# EAGLE design ScanGen10 (EAGLE 7.2.0)
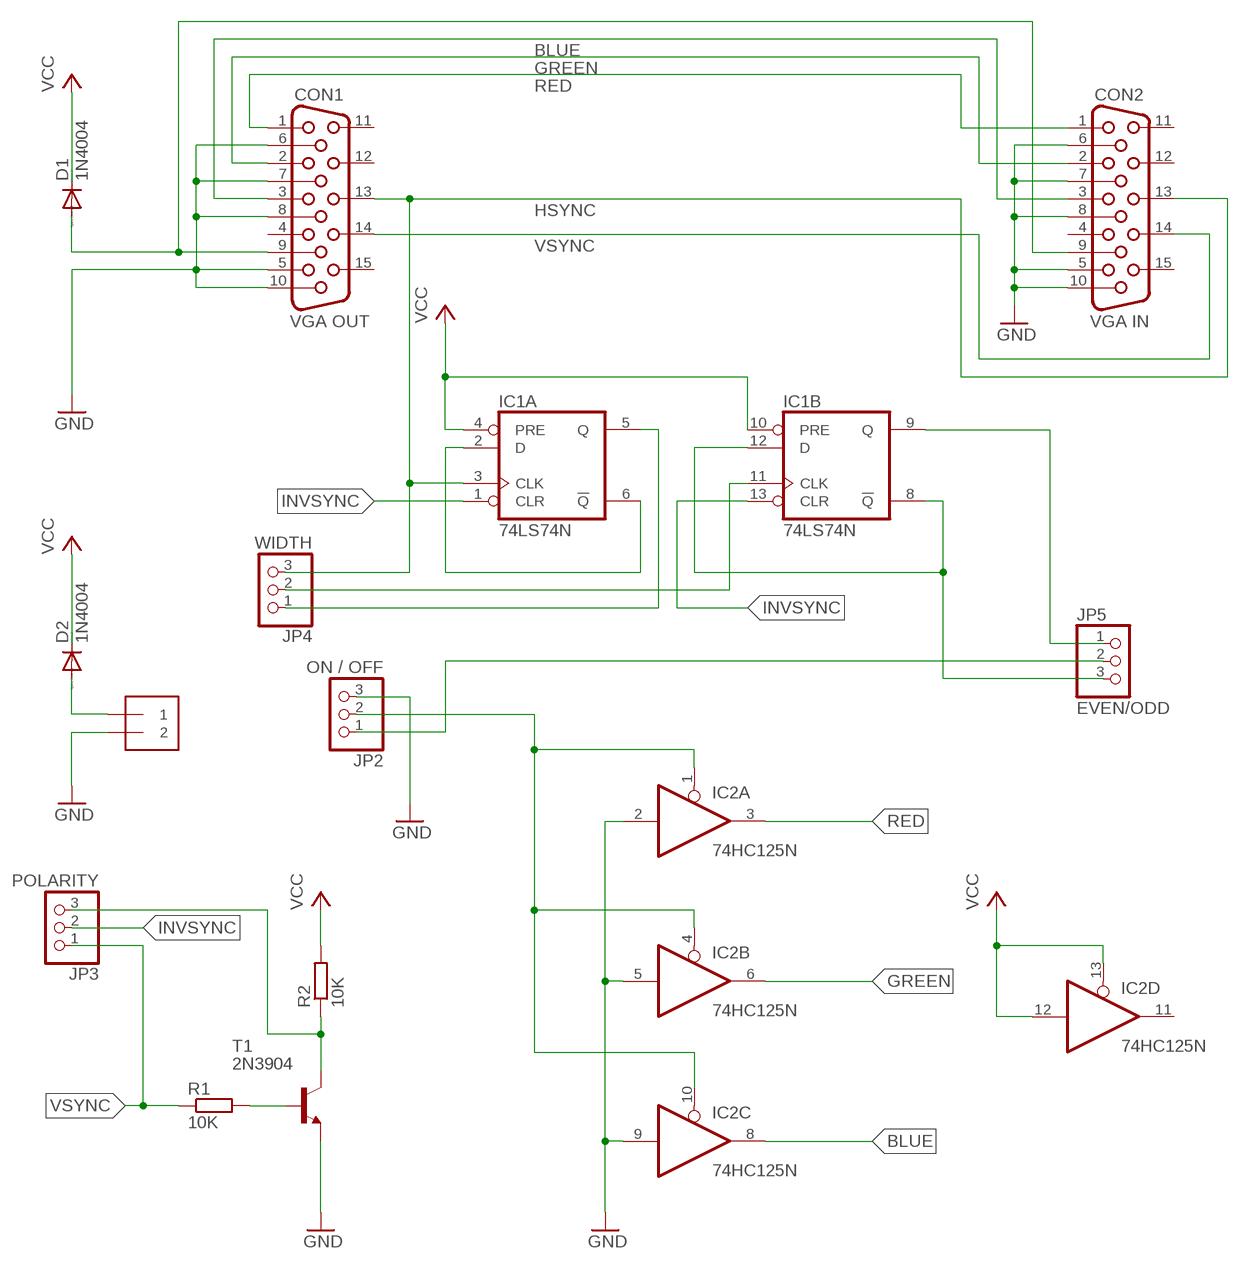
[diagram p0: schematic, sheet 1]

## Parts
CON1  VGA OUT  HF15H  [HDF15H]
CON2  VGA IN  HF15H  [HDF15H]
D1  1N4004  [DO41-10]
D2  1N4004  [DO41-10]
IC1  74LS74N  [DIL14]
IC2  74HC125N  [DIL14]
JP1  + 5V -  1X2-3.5MM  [1X2-3.5MM]
JP2  ON / OFF  PINHD-1X3  [1X03]
JP3  POLARITY  PINHD-1X3  [1X03]
JP4  WIDTH  PINHD-1X3  [1X03]
JP5  EVEN/ODD  PINHD-1X3  [1X03]
R1  10K  R-EU_0204/7  [0204/7]
R2  10K  R-EU_0204/7  [0204/7]
T1  2N3904  [TO92]

## Nets
BLUE: CON1.3 CON2.3 IC2.8(C:O)
GND: CON1.5 CON1.6 CON1.7 CON1.8 CON1.10 CON2.5 CON2.6 CON2.7 CON2.8 CON2.10 IC2.2(A:I) IC2.5(B:I) IC2.9(C:I) JP1.2 JP2.3 T1.3(E)
GREEN: CON1.2 CON2.2 IC2.6(B:O)
HSYNC: CON1.13 CON2.13 IC1.3(A:CLK) JP4.3
INVSYNC: IC1.1(A:CLR) IC1.13(B:CLR) JP3.2
N$1: CON1.9 CON2.9 D1.A
N$2: D2.A JP1.1
N$3: IC1.11(B:CLK) JP4.2
N$4: IC1.5(A:Q) JP4.1
N$5: IC1.2(A:D) IC1.6(A:!Q)
N$6: IC1.8(B:!Q) IC1.12(B:D) JP5.3
N$7: IC1.9(B:Q) JP5.1
N$8: IC2.1(A:OE) IC2.4(B:OE) IC2.10(C:OE) JP2.2
N$9: R1.2 T1.2(B)
N$11: JP3.3 R2.1 T1.1(C)
N$12: JP2.1 JP5.2
RED: CON1.1 CON2.1 IC2.3(A:O)
VCC: D1.C D2.C IC1.4(A:PRE) IC1.10(B:PRE) IC2.12(D:I) IC2.13(D:OE) R2.2
VSYNC: CON1.14 CON2.14 JP3.1 R1.1
Unconnected: CON1.4 CON1.11 CON1.12 CON1.15 CON2.4 CON2.11 CON2.12 CON2.15 IC2.11(D:O)

## Power pins joined to a net without a drawn wire
GND: IC1.7(P:GND) IC2.7(P:GND)
VCC: IC1.14(P:VCC) IC2.14(P:VCC)

## Library data of the parts
CON1 CON2 = con-subd:HF15: SUB-D; OC_FARNELL: unknown; OC_NEWARK: unknown
D1 D2 = diode:1N4004: DIODE general purpose rectifier, 1 A
IC1 = 74xx-eu:74*74: Dual D type positive edge triggered FLIP FLOP, preset and clear
IC2 = 74xx-eu:74*125: Quad bus BUFFER, 3-state
JP1 = adafruit:1X2: 3.5mm Terminal block http://www.ladyada.net/library/pcb/eaglelibrary.html
JP2-JP5 = pinhead:PINHD-1X3: PIN HEADER
R1 R2 = resistor:R-EU_: RESISTOR, European symbol
T1 = transistor:2N3904: NPN TRANSISTOR

## Board
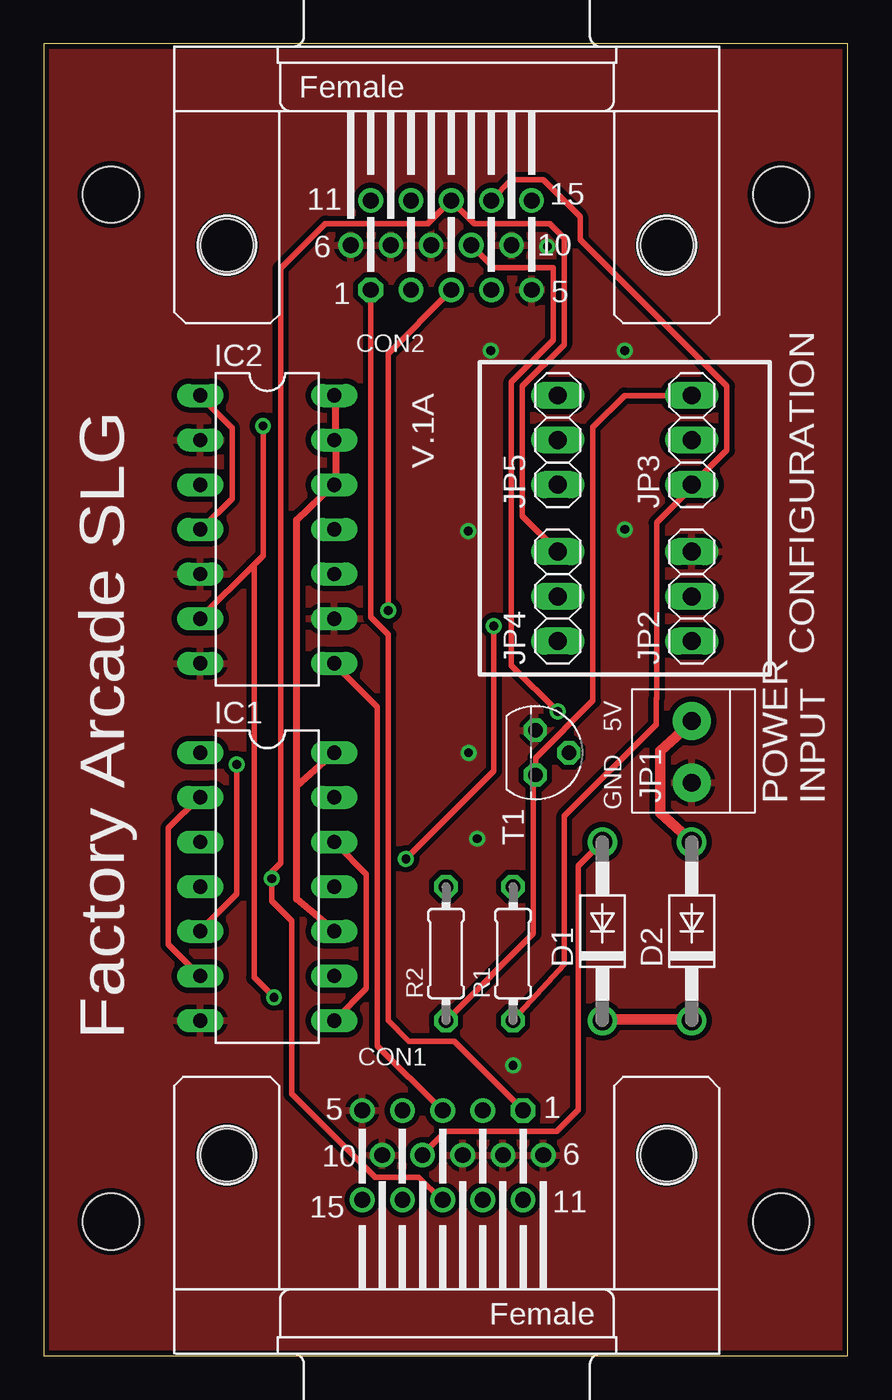
[diagram p1: board, top side]
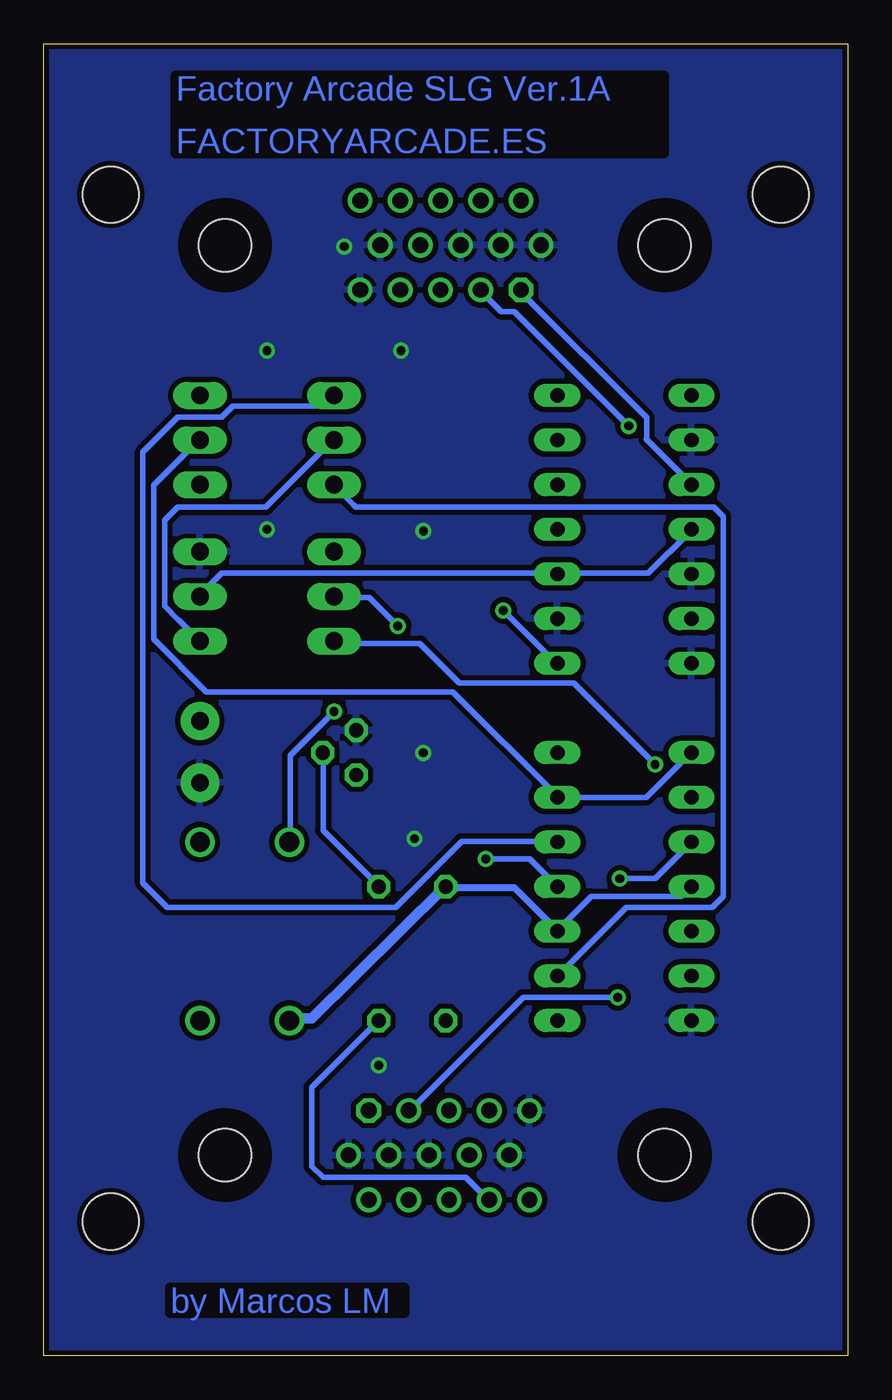
[diagram p2: board, bottom side, seen from below]

Size 45.7 x 74.6 mm. Coordinates in mm from the lower left corner, seen from the top.
Outline: 0,0 45.7,0 45.7,74.6 0,74.6 0,0
Copper layers (1*16): Top 0.035mm / dielectric 1.5mm / Bottom 0.035mm
Design rules "paredes_clase3": minimum track width 0.3mm, minimum drill 0.5mm, track to track 0.3mm, track to pad 0.3mm, pad to pad 0.3mm, via to via 0.3mm, smd to smd 8mil, copper to edge 0.3mm, drill to drill 0.4mm, minimum pad ring 10mil, minimum via ring 8mil, stop-mask expansion 4mil, vias tented up to drill 0mil, thermal gap 10mil
Holes 3.2 mm at 3.81,66.04 41.91,66.04 41.91,7.62 3.81,7.62

### Footprints (pad centres in the part's own frame; a part is rotated, then mirrored left to right if it is on the bottom)
HDF15H = drill 0.9 octagon: 1 4.329,2.54 | drill 0.9: 2 2.043,2.54; 3 -0.243,2.54; 4 -2.529,2.54; 5 -4.815,2.54; 6 5.472,0; 7 3.186,0; 8 0.9,0; 9 -1.386,0; 10 -3.672,0; 11 4.329,-2.54; 12 2.043,-2.54; 13 -0.243,-2.54; 14 -2.529,-2.54; 15 -4.815,-2.54 | hole 3: -12.5,0; 12.5,0
DO41-10 = drill 1.118: A 5.08,0; C -5.08,0
DIL14 = drill 0.813 long: 1 -7.62,-3.81; 2 -5.08,-3.81; 3 -2.54,-3.81; 4 0,-3.81; 5 2.54,-3.81; 6 5.08,-3.81; 7 7.62,-3.81; 8 7.62,3.81; 9 5.08,3.81; 10 2.54,3.81; 11 0,3.81; 12 -2.54,3.81; 13 -5.08,3.81; 14 -7.62,3.81
1X2-3.5MM = drill 1 pad 2.184: 1 1.8,0; 2 -1.7,0
1X03 = drill 1.016 long: 1 -2.54,0; 2 0,0; 3 2.54,0
0204/7 = drill 0.813 octagon: 1 -3.81,0; 2 3.81,0
TO92 = drill 0.813 octagon: 1 1.27,0; 2 0,1.905; 3 -1.27,0

### Placement (x,y rotation side)
CON1  22.91,11.4 0 top
CON2  22.91,63.15 180 top
D1  31.75,24.13 90 top
D2  36.83,24.13 90 top
IC1  12.7,26.67 270 top
IC2  12.7,46.99 270 top
JP1  36.83,34.29 90 top
JP2  36.83,43.18 90 top
JP3  36.83,52.07 90 top
JP4  29.21,43.18 90 top
JP5  29.21,52.07 90 top
R1  26.67,22.86 90 top
R2  22.86,22.86 90 top
T1  27.94,34.29 270 top

### Tracks (layer width: path | path; a pad name or v marks a point on that pad's centre or on a via)
BLUE  (via drill 0.5)
  Top 0.3: IC2.8 16.58,39.25 18.95,36.88 18.95,17.62 22.58,14 CON1.3 | v19.58,42.38 19.58,57 23.08,60.5 CON2.3
  Bottom 0.3: v19.58,42.38 16.58,39.38 IC2.8
GND  (via drill 0.5)
  other vias: 24.63,29.4 24.12,46.9 24.14,34.28 25.4,57.15 33.02,46.99 33.02,57.15 28.63,63.08 26.67,16.51
  pour Top: -3.81,82.55 -3.81,-1.27 49.53,-1.27 49.53,82.55
  pour Bottom: -2.54,-1.27 -2.54,82.55 48.26,82.55 48.26,-1.27
GREEN  (via drill 0.5)
  Top 0.3: 11.89,44.94 12.46,45.5 v12.46,52.88 | 11.89,44.94 8.96,42 IC2.6 | v13.08,20.38 11.96,21.5 11.96,44.88 11.89,44.94
  Bottom 0.3: v12.46,52.88 18.95,59.38 19.7,59.38 20.83,60.5 CON2.2 | v13.08,20.38 18.45,20.38 24.83,14 CON1.2
HSYNC  (via drill 0.5)
  Top 0.3: 24.45,64.38 23.2,65.62 CON2.13 23.08,65.62 21.91,64.45 21.83,64.38 | 29.58,57.5 27.2,55.12 27.2,47.75 29.2,45.75 JP4.3 | 14.08,24.73 14.08,14.88 18.83,10.12 21.31,10.12 22.58,8.88 CON1.13
  Top 0.305: 14.08,24.73 12.96,25.86 v12.96,27.12 12.96,27.52 13.46,28.02 13.46,61.84 16,64.39 21.84,64.39 21.91,64.45 | 24.45,64.38 28.77,64.38 29.58,63.56 29.58,57.5 | 29.58,57.5
  Bottom 0.3: v12.96,27.12 10.96,27.12 8.96,29.12 IC1.3
INVSYNC
  Bottom 0.3: IC1.1 8.96,34.25 11.46,31.75 IC1.13 16.58,31.88 22.45,37.75 | 39.3,49.68 38.05,50.93 38.03,50.93 36.78,52.18 JP3.2
  Bottom 0.305: 22.45,37.75 36.48,37.75 39.45,40.74 39.45,49.52 39.3,49.68
N$1  (via drill 0.5)
  Top 0.3: 22.83,12.75 21.58,11.5 CON1.9 | 30.4,27.88 31.65,29.12 D1.A | v29.2,36.62 26.58,39.25 26.58,55.38 28.95,57.75 28.95,61.88 25.58,61.88 24.33,63.12 CON2.9
  Top 0.305: 22.83,12.75 29.16,12.75 30.38,13.97 30.38,27.85 30.4,27.88
  Bottom 0.3: v29.2,36.62 31.7,34.12 31.7,29.25 D1.A
N$2
  Top 0.3: 36.83,29.25 D2.A | 36.83,36 JP1.1
  Top 0.61: 36.83,29.25 35.05,30.88 35.05,34.38 36.83,36
N$3  (via drill 0.5)
  Top 0.3: v20.58,28.25 25.58,33.25 v25.58,41.5
  Bottom 0.3: v20.58,28.25 18.08,28.25 16.58,26.75 IC1.11 | v25.58,41.5 27.2,43.12 29.2,43.12 JP4.2
N$4  (via drill 0.5)
  Top 0.3: v10.96,33.62 10.96,26.25 8.96,24.25 IC1.5
  Bottom 0.3: v10.96,33.62 15.58,38.25 22.08,38.25 24.33,40.5 29.08,40.5 29.2,40.62 JP4.1
N$5
  Top 0.3: IC1.6 8.83,21.62 7.08,23.38 7.08,30 8.83,31.75 IC1.2
N$6
  Top 0.3: IC1.8 16.58,19.12 18.33,20.88 18.33,27.38 16.58,29.12 IC1.12
  Bottom 0.3: 40.08,51.38 38.08,53.38 35.58,53.38 34.95,54 29.83,54 29.33,54.5 JP5.3 | 25.7,25.5 21.95,29.25 16.58,29.25 IC1.12
  Bottom 0.305: 25.7,25.5 38.7,25.5 40.08,26.88 40.08,51.37 40.08,51.38
N$7
  Bottom 0.3: 7.08,26.12 7.71,25.5 12.58,25.5 16.45,21.62 IC1.9 | 28.08,48.38 29.2,49.5 JP5.1
  Bottom 0.305: 7.08,26.12 7.08,47.72 7.62,48.26 27.97,48.26 28.08,48.38
N$8
  Top 0.3: IC2.1 8.96,54.5 10.71,52.75 10.71,48.75 8.96,47 IC2.4
  Bottom 0.3: IC2.4 8.96,46.88 11.33,44.5 16.45,44.5 IC2.10 16.58,44.5 35.58,44.5 36.83,43.25 JP2.2
N$9
  Bottom 0.3: R1.2 26.7,26.75 29.83,29.88 29.83,34.25 T1.2
N$11
  Top 0.3: R2.1 22.95,19.12 27.83,24 27.83,33 T1.1 27.95,33.12 27.95,34 31.2,37.25 | 36.83,54.5 JP3.3
  Top 0.305: 31.2,37.25 31.2,52.8 33.02,54.61 JP3.3
N$12
  Bottom 0.3: 38.83,42.62 38.08,41.88 38.03,41.82 36.9,40.7 JP2.1 | 33.08,48.25 29.33,52 JP5.2
  Bottom 0.305: 38.83,42.62 38.83,47.53 38.1,48.26 33.09,48.26 33.08,48.25
RED
  Top 0.3: 23.33,17.88 27.2,14 CON1.1 | 19.58,41 18.58,42 18.58,60.5 CON2.1
  Top 0.305: 23.33,17.88 20.75,17.88 19.58,19.05 19.58,41 | 19.58,41
  Bottom 0.3: 11.46,52.12 8.96,49.62 IC2.3 | 18.58,60.5 CON2.1
  Bottom 0.305: 11.46,52.12 11.43,52.15 11.43,53.34 18.58,60.49 CON2.1
VCC
  Top 0.3: 31.83,19.12 D1.C | 36.83,19.12 D2.C | 16.58,49.62 IC2.12 16.45,49.5 | 16.58,52 IC2.13 16.58,52.12 | 16.58,54.5 IC2.14 | 14.36,32.47 14.36,32.41 | 16.45,34.25 IC1.14 | 16.45,24.25 IC1.10
  Top 0.406: 16.58,52 16.58,49.62 | 16.58,52.12 16.58,54.5 | 14.36,32.41 16.45,34.25 | 16.45,24.25 14.36,25.97 14.36,32.41 14.36,32.47 14.36,47.53 16.45,49.5
  Top 0.61: 36.83,19.12 31.83,19.12
  Bottom 0.3: 16.58,24.25 IC1.10 16.45,24.25 14.58,26.12 9.46,26.12 8.96,26.62 IC1.4 | 22.83,26.62 R2.2 22.95,26.62 | 31.7,19.12 D1.C
  Bottom 0.406: 16.58,24.25 18.95,26.62 22.83,26.62
  Bottom 0.61: 31.7,19.12 31.72,19.17 30.47,19.17 22.95,26.62
VSYNC
  Top 0.3: 26.58,66.88 25.45,65.75 CON2.14 | 33.45,60.5 38.83,55.12 38.83,51.5 36.83,49.5 JP3.1 36.83,49.38 34.83,47.38 34.83,37.38 | 29.59,22.25 26.7,19.12 R1.1
  Top 0.305: 26.58,66.88 28.38,66.88 30.48,64.77 30.48,63.48 33.45,60.5 | 29.59,22.25 29.59,30.68 34.82,35.91 34.82,37.38 34.83,37.38
  Bottom 0.3: 29.83,10.12 21.7,10.12 20.45,8.88 CON1.14 | 26.7,19 R1.1
  Bottom 0.305: 29.83,10.12 30.48,10.78 30.48,15.24 R1.1

### Text on the board
Bottom: Factory Arcade SLG Ver.1A / FACTORYARCADE.ES | by Marcos LM
tNames: V.1A | CONFIGURATION | 5V | GND | POWER / INPUT | Factory Arcade SLG